# Altium schematic sheet HDMI.SchDoc
size A2; SheetNumber: 22; SheetTotal: 23
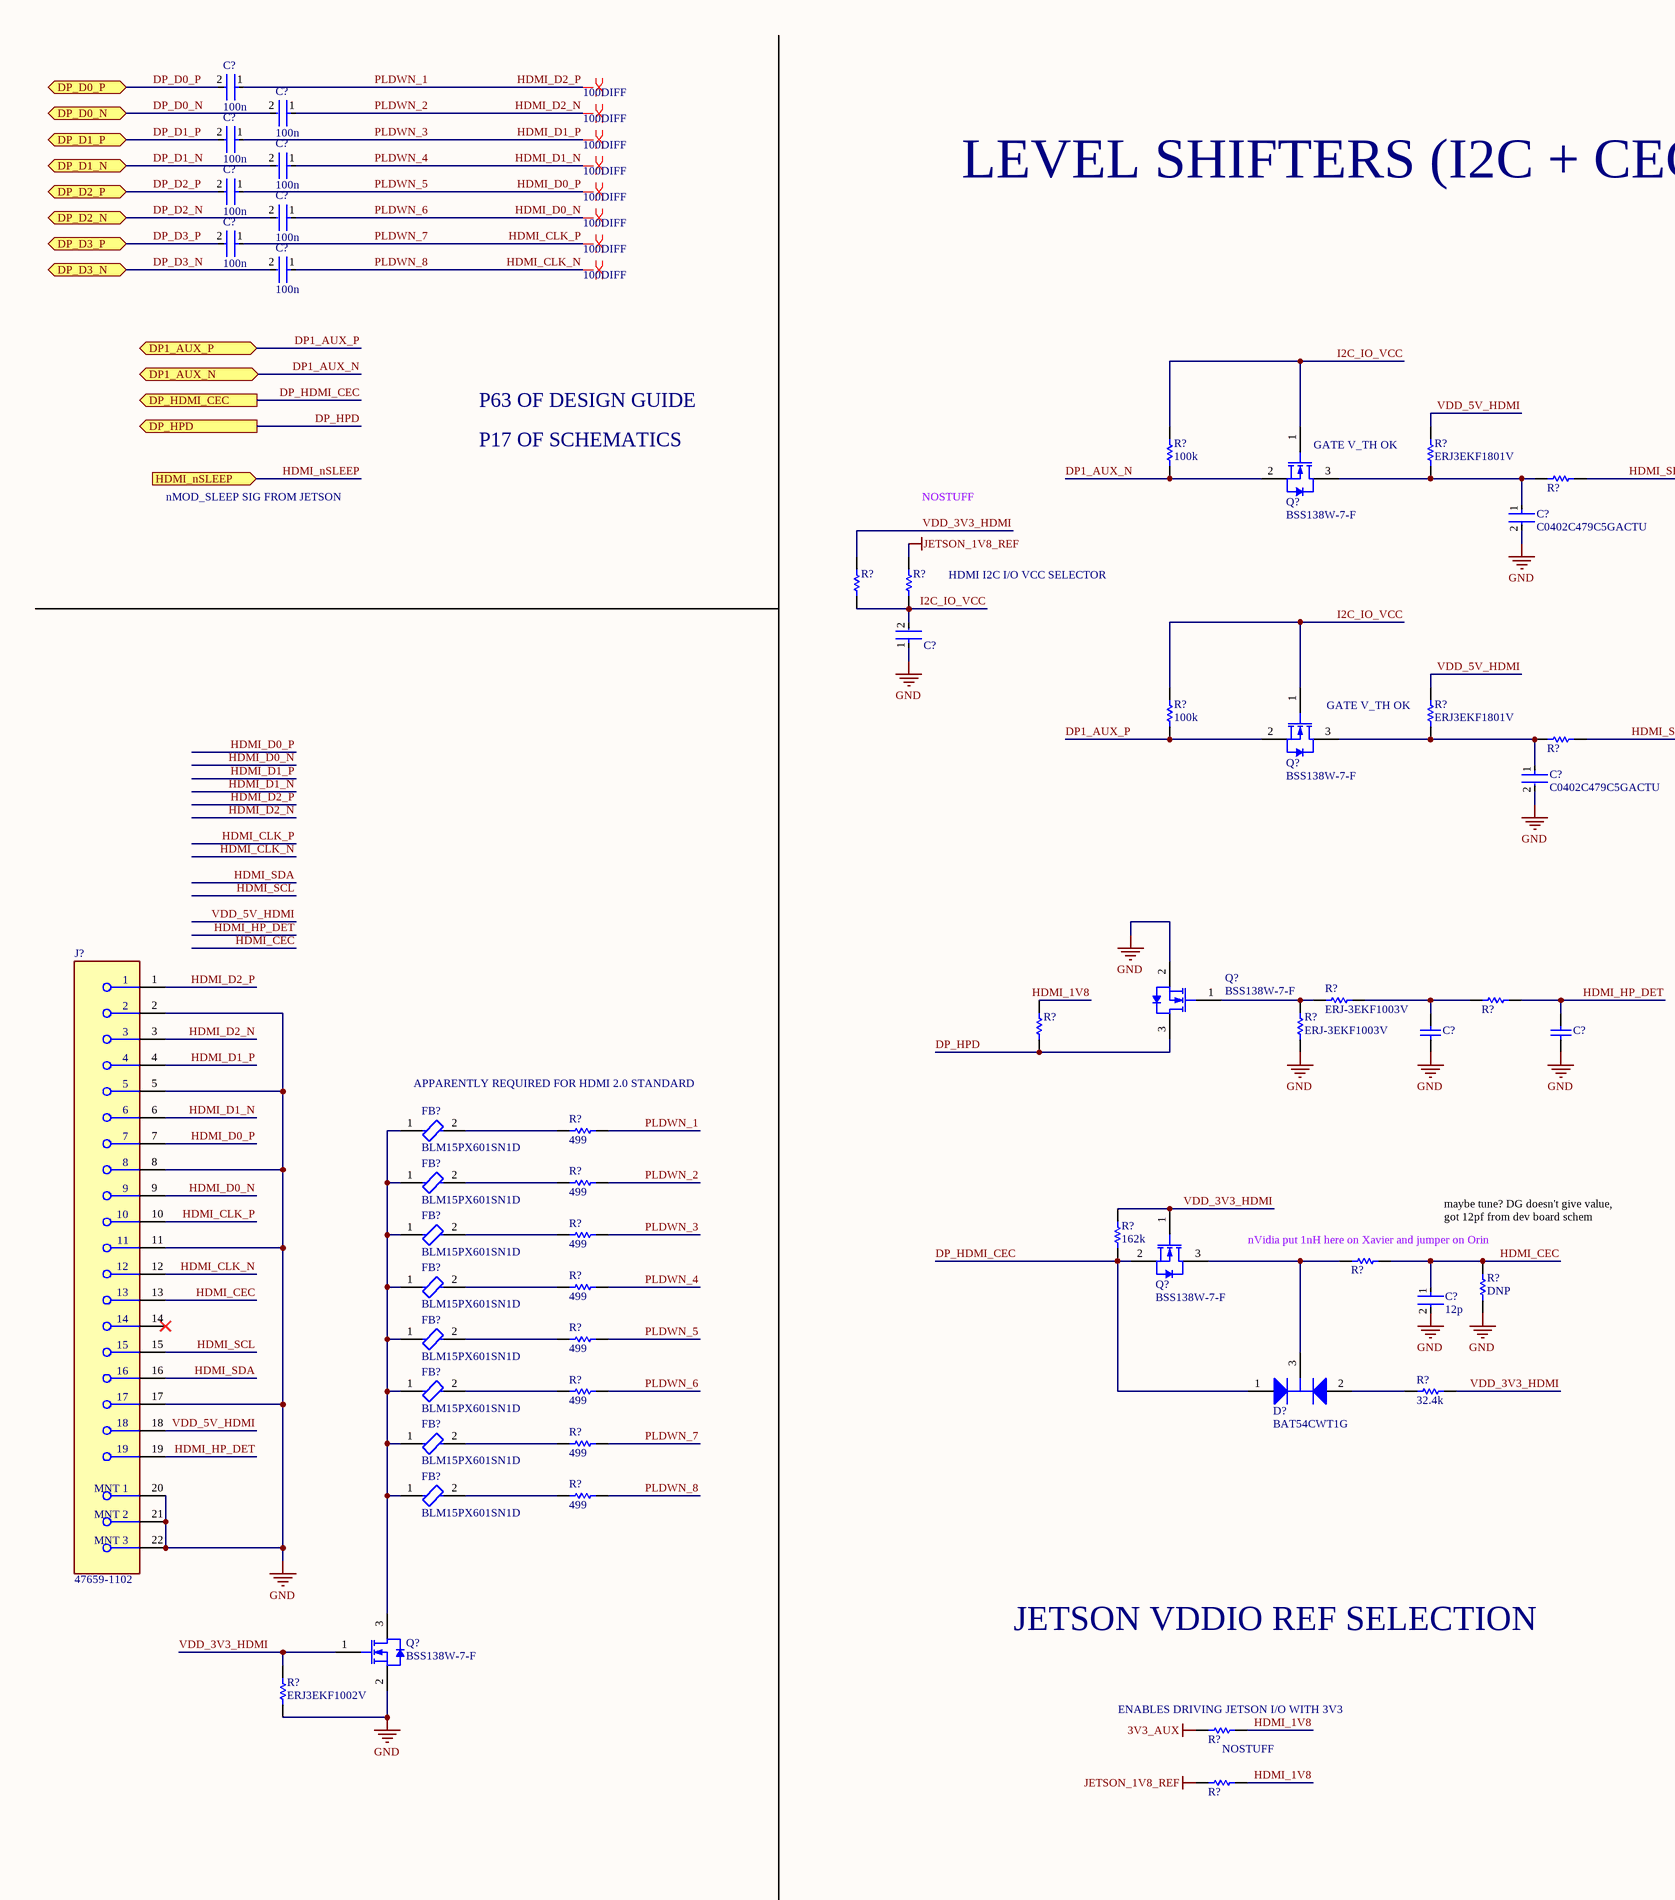
[diagram p0: HDMI.SchDoc, left]
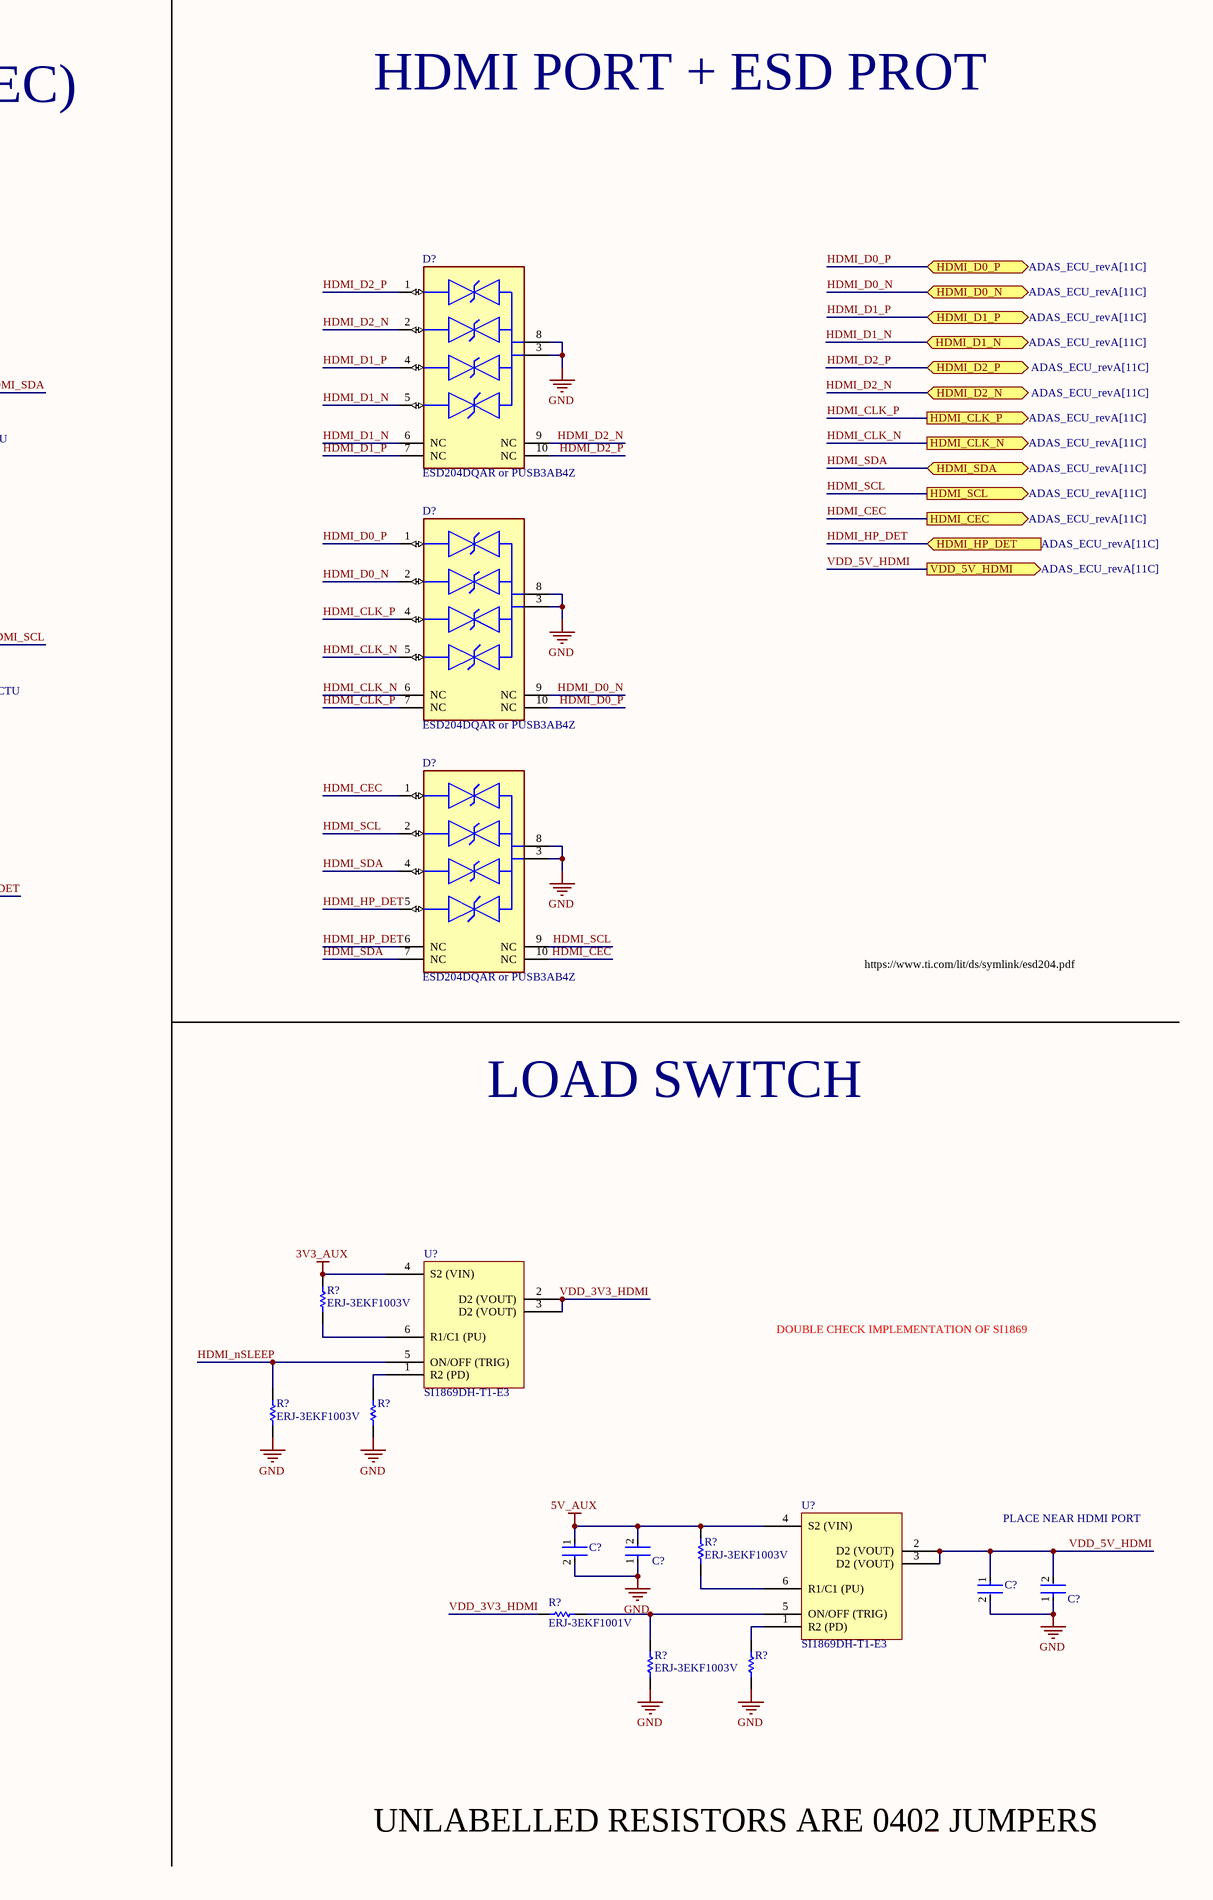
[diagram p1: HDMI.SchDoc, right]

## Parts
(Parts that share a designator on the sheet are numbered #1, #2 ... from top to bottom, then left to right.)
C?#1  100n  [FP-0402-L_1_0_0_05-W_0_5-IPC_A]
C?#2  100n  [FP-0402-L_1_0_0_05-W_0_5-IPC_A]
C?#3  100n  [FP-0402-L_1_0_0_05-W_0_5-IPC_A]
C?#4  100n  [FP-0402-L_1_0_0_05-W_0_5-IPC_A]
C?#5  100n  [FP-0402-L_1_0_0_05-W_0_5-IPC_A]
C?#6  100n  [FP-0402-L_1_0_0_05-W_0_5-IPC_A]
C?#7  100n  [FP-0402-L_1_0_0_05-W_0_5-IPC_A]
C?#8  100n  [FP-0402-L_1_0_0_05-W_0_5-IPC_A]
C?#9  C0402C479C5GACTU  [FP-C0402-BB-MFG]
C?#10  C1005X7R1H104K050BB  [FP-C1005-050-0_05-IPC_C]  (value not drawn)
C?#11  C0402C479C5GACTU  [FP-C0402-BB-MFG]
C?#12  C0402C221K5RAC7867  [CAPC1005X60X30NL05T10]  (value not drawn)
C?#13  C0402C221K5RAC7867  [CAPC1005X60X30NL05T10]  (value not drawn)
C?#14  12p  [FP-0402-L_1_0_0_05-W_0_5-IPC_A]
C?#15  GRM188R60J106ME47D  [FP-GRM188-0_1-e0_2_0_55-IPC_A]  (value not drawn)
C?#16  C1005X7R1H104K050BB  [FP-C1005-050-0_05-IPC_C]  (value not drawn)
C?#17  GRM188R60J106ME47D  [FP-GRM188-0_1-e0_2_0_55-IPC_A]  (value not drawn)
C?#18  C1005X7R1H104K050BB  [FP-C1005-050-0_05-IPC_C]  (value not drawn)
D?#1  ESD204DQAR or PUSB3AB4Z  [FP-DQA0010A-MFG]
D?#2  ESD204DQAR or PUSB3AB4Z  [FP-DQA0010A-MFG]
D?#3  ESD204DQAR or PUSB3AB4Z  [FP-DQA0010A-MFG]
D?#4  BAT54CWT1G  [ONSC-SOT-323-3-419-04_V]
FB?#1  BLM15PX601SN1D  [FP-BLM15-0_05-MFG]
FB?#2  BLM15PX601SN1D  [FP-BLM15-0_05-MFG]
FB?#3  BLM15PX601SN1D  [FP-BLM15-0_05-MFG]
FB?#4  BLM15PX601SN1D  [FP-BLM15-0_05-MFG]
FB?#5  BLM15PX601SN1D  [FP-BLM15-0_05-MFG]
FB?#6  BLM15PX601SN1D  [FP-BLM15-0_05-MFG]
FB?#7  BLM15PX601SN1D  [FP-BLM15-0_05-MFG]
FB?#8  BLM15PX601SN1D  [FP-BLM15-0_05-MFG]
J?  47659-1102  [FP-47659-1102-MFG]
Q?#1  BSS138W-7-F  [DIOD-SOT323-3_V]
Q?#2  BSS138W-7-F  [DIOD-SOT323-3_V]
Q?#3  BSS138W-7-F  [DIOD-SOT323-3_V]
Q?#4  BSS138W-7-F  [DIOD-SOT323-3_V]
Q?#5  BSS138W-7-F  [DIOD-SOT323-3_V]
R?#1  100k  [R0603B]
R?#2  ERJ3EKF1801V  [RESC1608X55X30LL15T15]
R?#3  0402 JUMPER  [RESC1005X40X25ML05T05]  (value not drawn)
R?#4  0402 JUMPER  [RESC1005X40X25ML05T05]  (value not drawn)
R?#5  0402 JUMPER  [RESC1005X40X25ML05T05]  (value not drawn)
R?#6  100k  [R0603B]
R?#7  ERJ3EKF1801V  [RESC1608X55X30LL15T15]
R?#8  0402 JUMPER  [RESC1005X40X25ML05T05]  (value not drawn)
R?#9  ERJ-3EKF1003V  [RESC1608X55X30ML15T15]
R?#10  0402 JUMPER  [RESC1005X40X25ML05T05]  (value not drawn)
R?#11  ERJ3EKF1002V  [RESC1609X55X30LL15T15]  (value not drawn)
R?#12  ERJ-3EKF1003V  [RESC1608X55X30ML15T15]
R?#13  499  [R0603B]
R?#14  499  [R0603B]
R?#15  499  [R0603B]
R?#16  162k  [R0603B]
R?#17  0402 JUMPER  [RESC1005X40X25ML05T05]  (value not drawn)
R?#18  499  [R0603B]
R?#19  DNP  [R0603B]
R?#20  499  [R0603B]
R?#21  499  [R0603B]
R?#22  32.4k  [R0603B]
R?#23  ERJ-3EKF1003V  [RESC1608X55X30ML15T15]
R?#24  499  [R0603B]
R?#25  499  [R0603B]
R?#26  0402 JUMPER  [RESC1005X40X25ML05T05]  (value not drawn)
R?#27  ERJ-3EKF1003V  [RESC1608X55X30ML15T15]
R?#28  ERJ-3EKF1003V  [RESC1608X55X30ML15T15]
R?#29  ERJ3EKF1002V  [RESC1609X55X30LL15T15]
R?#30  0402 JUMPER  [RESC1005X40X25ML05T05]  (value not drawn)
R?#31  ERJ-3EKF1001V  [RESC1608X55X30LL15T15]
R?#32  0402 JUMPER  [RESC1005X40X25ML05T05]  (value not drawn)
R?#33  0402 JUMPER  [RESC1005X40X25ML05T05]  (value not drawn)
R?#34  ERJ-3EKF1003V  [RESC1608X55X30ML15T15]
U?#1  SI1869DH-T1-E3  [SOT65P242X110-6N]
U?#2  SI1869DH-T1-E3  [SOT65P242X110-6N]

## Ports
DP1_AUX_N (bidir, see ADAS_ECU_revA[10C]), DP1_AUX_P (bidir, see ADAS_ECU_revA[10C]), DP_D0_N (bidir, see ADAS_ECU_revA[10C]), DP_D0_P (bidir, see ADAS_ECU_revA[10C]), DP_D1_N (bidir, see ADAS_ECU_revA[10C]), DP_D1_P (bidir, see ADAS_ECU_revA[10C]), DP_D2_N (bidir, see ADAS_ECU_revA[10C]), DP_D2_P (bidir, see ADAS_ECU_revA[10C]), DP_D3_N (bidir, see ADAS_ECU_revA[10C]), DP_D3_P (bidir, see ADAS_ECU_revA[10C]), DP_HDMI_CEC (out, see ADAS_ECU_revA[10C]), DP_HPD (out, see ADAS_ECU_revA[10C]), HDMI_CEC (out, see ADAS_ECU_revA[11C]), HDMI_CLK_N (out, see ADAS_ECU_revA[11C]), HDMI_CLK_P (out, see ADAS_ECU_revA[11C]), HDMI_D0_N (bidir, see ADAS_ECU_revA[11C]), HDMI_D0_P (bidir, see ADAS_ECU_revA[11C]), HDMI_D1_N (bidir, see ADAS_ECU_revA[11C]), HDMI_D1_P (bidir, see ADAS_ECU_revA[11C]), HDMI_D2_N (bidir, see ADAS_ECU_revA[11C]), HDMI_D2_P (bidir, see ADAS_ECU_revA[11C]), HDMI_HP_DET (in, see ADAS_ECU_revA[11C]), HDMI_nSLEEP (in, see ADAS_ECU_revA[10C]), HDMI_SCL (out, see ADAS_ECU_revA[11C]), HDMI_SDA (bidir, see ADAS_ECU_revA[11C]), VDD_5V_HDMI (out, see ADAS_ECU_revA[11C])

## Nets
3V3_AUX: R?#23.2 R?#30.1 U?#1.4(S2_(VIN))
5V_AUX: C?#15.1 C?#16.2 R?#28.2 U?#2.4(S2_(VIN))
GND: C?#9.2 C?#10.1 C?#11.2 C?#12.1 C?#13.1 C?#14.2 C?#15.2 C?#16.1 C?#17.2 C?#18.1 D?#1.3(GND) D?#1.8(GND) D?#2.3(GND) D?#2.8(GND) D?#3.3(GND) D?#3.8(GND) J?.2 J?.5 J?.8 J?.11 J?.17 J?.20(MNT_1) J?.21(MNT_2) J?.22(MNT_3) Q?#3.2(S) Q?#5.2(S) R?#12.1 R?#19.1 R?#26.2 R?#27.1 R?#29.1 R?#33.2 R?#34.1
JETSON_1V8_REF: R?#5.2 R?#32.1
DP1_AUX_N: Q?#1.2(S) R?#1.1 ; port DP1_AUX_N
DP1_AUX_P: Q?#2.2(S) R?#6.1 ; port DP1_AUX_P
DP_D0_N: C?#2.2 ; port DP_D0_N
DP_D0_P: C?#1.2 ; port DP_D0_P
DP_D1_N: C?#4.2 ; port DP_D1_N
DP_D1_P: C?#3.2 ; port DP_D1_P
DP_D2_N: C?#6.2 ; port DP_D2_N
DP_D2_P: C?#5.2 ; port DP_D2_P
DP_D3_N: C?#8.2 ; port DP_D3_N
DP_D3_P: C?#7.2 ; port DP_D3_P
DP_HDMI_CEC: D?#4.1(A1) Q?#4.2(S) R?#16.2 ; port DP_HDMI_CEC
DP_HPD: Q?#3.3(D) R?#11.1 ; port DP_HPD
HDMI_1V8: R?#11.2 R?#30.2 R?#32.2
HDMI_CEC: C?#14.1 D?#3.1(IO1) D?#3.10(NC) J?.13 R?#17.2 R?#19.2 ; port HDMI_CEC
HDMI_CLK_N: C?#8.1 D?#2.5(IO4) D?#2.6(NC) J?.12 R?#25.2 ; port HDMI_CLK_N  [also labelled PLDWN_8]
HDMI_CLK_P: C?#7.1 D?#2.4(IO3) D?#2.7(NC) J?.10 R?#24.2 ; port HDMI_CLK_P  [also labelled PLDWN_7]
HDMI_D0_N: C?#6.1 D?#2.2(IO2) D?#2.9(NC) J?.9 R?#21.2 ; port HDMI_D0_N  [also labelled PLDWN_6]
HDMI_D0_P: C?#5.1 D?#2.1(IO1) D?#2.10(NC) J?.7 R?#20.2 ; port HDMI_D0_P  [also labelled PLDWN_5]
HDMI_D1_N: C?#4.1 D?#1.5(IO4) D?#1.6(NC) J?.6 R?#18.2 ; port HDMI_D1_N  [also labelled PLDWN_4]
HDMI_D1_P: C?#3.1 D?#1.4(IO3) D?#1.7(NC) J?.4 R?#15.2 ; port HDMI_D1_P  [also labelled PLDWN_3]
HDMI_D2_N: C?#2.1 D?#1.2(IO2) D?#1.9(NC) J?.3 R?#14.2  [also labelled PLDWN_2]
HDMI_D2_P: C?#1.1 D?#1.1(IO1) D?#1.10(NC) J?.1 R?#13.2 ; port HDMI_D2_P  [also labelled PLDWN_1]
HDMI_HP_DET: C?#13.2 D?#3.5(IO4) D?#3.6(NC) J?.19 R?#10.2 ; port HDMI_HP_DET
HDMI_nSLEEP: R?#27.2 U?#1.5(ON/OFF_(TRIG)) ; port HDMI_nSLEEP
HDMI_SCL: D?#3.2(IO2) D?#3.9(NC) J?.15 R?#8.2 ; port HDMI_SCL
HDMI_SDA: D?#3.4(IO3) D?#3.7(NC) J?.16 R?#3.2 ; port HDMI_SDA
I2C_IO_VCC: C?#10.2 Q?#1.1(G) Q?#2.1(G) R?#1.2 R?#4.1 R?#5.1 R?#6.2
VDD_3V3_HDMI: Q?#4.1(G) Q?#5.1(G) R?#4.2 R?#16.1 R?#22.1 R?#29.2 R?#31.1 U?#1.2(D2_(VOUT)) U?#1.3(D2_(VOUT))
VDD_5V_HDMI: C?#17.1 C?#18.2 J?.18 R?#2.2 R?#7.2 U?#2.2(D2_(VOUT)) U?#2.3(D2_(VOUT)) ; port VDD_5V_HDMI
NetC?#9_1: C?#9.1 Q?#1.3(D) R?#2.1 R?#3.1
NetC?#11_1: C?#11.1 Q?#2.3(D) R?#7.1 R?#8.1
NetC?#12_2: C?#12.2 R?#9.2 R?#10.1
NetD?#4_2: D?#4.2(A2) R?#22.2
NetD?#4_3: D?#4.3(K) Q?#4.3(D) R?#17.1
NetFB?#1_1: FB?#1.1 FB?#2.1 FB?#3.1 FB?#4.1 FB?#5.1 FB?#6.1 FB?#7.1 FB?#8.1 Q?#5.3(D)
NetFB?#1_2: FB?#1.2 R?#13.1
NetFB?#2_2: FB?#2.2 R?#14.1
NetFB?#3_2: FB?#3.2 R?#15.1
NetFB?#4_2: FB?#4.2 R?#18.1
NetFB?#5_2: FB?#5.2 R?#20.1
NetFB?#6_2: FB?#6.2 R?#21.1
NetFB?#7_2: FB?#7.2 R?#24.1
NetFB?#8_2: FB?#8.2 R?#25.1
NetQ?#3_1: Q?#3.1(G) R?#9.1 R?#12.2
NetR?#23_1: R?#23.1 U?#1.6(R1/C1_(PU))
NetR?#26_1: R?#26.1 U?#1.1(R2_(PD))
NetR?#28_1: R?#28.1 U?#2.6(R1/C1_(PU))
NetR?#31_2: R?#31.2 R?#34.2 U?#2.5(ON/OFF_(TRIG))
NetR?#33_1: R?#33.1 U?#2.1(R2_(PD))

Not connected (* = marked no-connect by the designer): J? 14*

## Layout directives
differential pair; differential pair class 100DIFF: HDMI_CLK_N, HDMI_CLK_P, HDMI_D0_N, HDMI_D0_P, HDMI_D1_N, HDMI_D1_P, HDMI_D2_N, HDMI_D2_P

## Notes on the sheet
- HDMI PORT + ESD PROT
- LEVEL SHIFTERS (I2C + CEC)
- P63 OF DESIGN GUIDE
- nMOD_SLEEP SIG FROM JETSON
- P17 OF SCHEMATICS
- NOSTUFF
- (near Q?#1) GATE V_TH OK
- HDMI I2C I/O VCC SELECTOR
- (near Q?#2) GATE V_TH OK
- APPARENTLY REQUIRED FOR HDMI 2.0 STANDARD
- https://www.ti.com/lit/ds/symlink/esd204.pdf
- maybe tune? DG doesn't give value, got 12pf from dev board schem
- LOAD SWITCH
- (near R?#17) nVidia put 1nH here on Xavier and jumper on Orin
- DOUBLE CHECK IMPLEMENTATION OF SI1869
- JETSON VDDIO REF SELECTION
- PLACE NEAR HDMI PORT
- (near R?#30) ENABLES DRIVING JETSON I/O WITH 3V3
- (near R?#30) NOSTUFF
- UNLABELLED RESISTORS ARE 0402 JUMPERS
- Labels drawn without touching a wire or pin: HDMI_D2_N

## Library data of the parts
C?#1-C?#8 C?#14 = CMP-001-00058-1: LARGE PADS, 0402 CAP, CHANGE COMMENT TO MATCH REAL P/N; Capacitor Type: Ceramic; Min Operating Temperature: -55°C; Mounting Technology: Surface Mount; Pins: 2; Case/Package: 0402; RoHS Compliant: Yes; Max Operating Temperature: 85°C
C?#9 C?#11 = CMP-2008-03310-2: CAP CER 4.7PF 50V NP0 0402; Manufacturer: Kemet; Material: Ceramic; Tolerance: 0.25 pF; Temperature Coefficient: 15%; Temperature Characteristic: C0G; Manufacturer Part Number: C0402C479C5GACTU; Lead Free: Yes; Device Class L1: Passive Components; ComponentLink2Description: Datasheet; Temperature: -55°C to +125°C; Digikey Description: CAP CER 4.7PF 50V NP0 0402; Ipc Land Pattern Name: CAPC10050X50; ComponentLink2URL: https://content.kemet.com/datasheets/KEM_C1002_X7R_SMD.pdf; Octopart: https://octopart.com/c0402c479c5gactu-kemet-9144199; Mouser Description: Multilayer Ceramic Capacitors MLCC - SMD/SMT 50volts 4.7pF C0G .25pF; Automotive: No; Voltage Rating: 50 V; Device Class L3: Ceramic Capacitors; Capacitance: 4.7 pF; Category: Cap; Value: 4.7 pF; Package: C0402-BB; Height: 0.55mm; Temperature Range Low: -55°C; RoHS: TRUE; Device Class L2: Capacitors; Temperature Range High: +125°C
C?#10 C?#16 C?#18 = CMP-2000-05393-2: Multilayer Ceramic Capacitors 100nF ±10% 50V X7R SMD 0402; Voltage: 50V; Dielectric Material: Ceramic; Min Operating Temperature: -55°C; Depth: 0.5mm; Radiation Hardening: No; RoHS Compliant: Yes; Voltage Rating (DC): 50V; Lead Free: Lead Free; Resistor Type: Ceramic; Height: 0.5mm; Dielectric: X7R; Thickness: 0.022inch; Case/Package: 0402; Case Code (Metric): 1005; Termination: SMD/SMT; Capacitance: 100nF; Packaging: Tape and Reel; Max Operating Temperature: 125°C; Mount: Surface Mount; Package Quantity: 1; Width: 0.02inch; Weight: 2.3E-05oz; Voltage Rating: 50V; Tolerance: 10%; Construction: Flat; Case Code (Imperial): 0402; Length: 1mm; REACH SVHC: No SVHC; Series: C
C?#12 C?#13 = CMP-2008-03137-2: Manufacturer: Kemet; Part Number: C0402C221K5RAC7867
C?#15 C?#17 = CMP-2006-02792-2: Chip Multilayer Ceramic Capacitors for General Purpose, 0603, 10uF, X5R, 15%, 20%, 6.3V; Packaging: Tape and Reel; Voltage Rating (DC): 6.3V; Width: 0.031inch; Termination: SMD/SMT; Dielectric: X5R; Package Quantity: 4000; Voltage Rating: 6.3V; Capacitance: 10uF; Case/Package: 0603; Min Operating Temperature: -55°C; Voltage: 6.3V; Length: 1.6mm; Thickness: 0.035inch; Lead Free: Lead Free; Depth: 0.8mm; Case Code (Imperial): 0603; Max Operating Temperature: 85°C; Material: Ceramic; Height: 0.8mm; Tolerance: 20%; Mount: Surface Mount; REACH SVHC: No SVHC; Radiation Hardening: No; Case Code (Metric): 1608
D?#1-D?#3 = CMP-04989-000002-1: 4-CHANNEL LOW-CAPACITANCE SURGE; Manufacturer: Texas Instruments; Value: 0.55pF; Reverse Standoff Voltage: 3.6V; Standoff Height: 0mm; Breakdown Voltage: 5.5V; Peak Pulse Current: 5.5A; Clamping Voltage: 11.5V; Direction: Bidirectional; Peak Pulse Power: 50W; Number Of Channels: 4; Ambient Temperature Range High: +125°C; ComponentLink2Description: Datasheet; Height: 0.55mm; Lead Free: Yes; Device Class L3: unset; Temperature Range High: +125°C; Temperature Range Low: -40°C; Package: DQA0010A; Temperature: -40°C to +125°C; Capacitance: 0.55pF; RoHS: TRUE; Mouser Description: 4-Channel Low-Capacitance Surge and ESD Protection Diode 10-USON -40 to 125; Category: Diode; Device Class L1: Circuit Protection; Octopart: https://octopart.com/esd204dqar-texas+instruments-89917476; Device Class L2: TVS Diodes; Ambient Temperature Range Low: -40°C; Manufacturer Part Number: ESD204DQAR; ComponentLink2URL: http://www.ti.com/lit/ds/symlink/esd204.pdf; Automotive: No; Digikey Description: 4-CHANNEL LOW-CAPACITANCE SURGE
D?#4 = CMP-1055-00557-1: Dual Series Cathode Schottky Barrier Diodes, 3-Pin SOT-323, Pb-Free, Tape and Reel; Manufacturer: On Semiconductor; Configuration: Common Cathode; IFSM Max (A): 0.6; trr Max (ns): 5; ComponentLink2Description: Datasheet; Packing: Tape and Reel; ComponentLink3Description: Package Specification; Mounting Technology: Surface Mount; PartNumber: BAT54CWT1G; PackageVersion: Rev. N, 11/2008; RoHS: TRUE; ComponentLink3URL: http://www.onsemi.com/pub_link/Collateral/419-04.PDF; ComponentLink2URL: http://www.onsemi.cn/pub_link/Collateral/BAT54CWT1-D.PDF; PackageReference: SOT-323-3-419-04; ComponentLink1URL: http://www.onsemi.com/; ComponentLink1Description: Manufacturer URL; DatasheetVersion: Rev. 7; PackageDescription: 3-Pin Small Outline Transistor, Body 2 x 1.25 mm, Pitch 0.65 mm
FB?#1-FB?#8 = CMP-0686-00252-4: Chip Ferrite Bead, 0402, 600Ω @ 100MHz, 0.23Ω, 25%, 900mA; Number of Circuits: 1; Impedance: 600R; DC Resistance (DCR): 230mR; Material: Steel; Length: 1mm; Package Quantity: 10000; Height: 0.5mm; Width: 0.5mm; Max DC Current: 900mA; Number of Lines: 1; Termination: SMD/SMT; Packaging: Tape and Reel; Lead Free: Lead Free; Min Operating Temperature: -55°C; Max Operating Temperature: 125°C; Max Current Rating: 900mA; Case Code (Imperial): 0402; Number of Pins: 2; Current Rating: 900mA; Test Frequency: 100MHz; Case/Package: 0402; Tolerance: 25%; Case Code (Metric): 1005
J? = CMP-04768-000010-1: HDMI REC.VERTICAL SMT TYPE W/HEI; RoHS Compliant: Yes
Q?#1-Q?#5 = CMP-2000-05968-1: N-Channel Enhancement Mode Mosfet, 50 V, 200 mA, -55 to 150 degC, 6-Pin SOT-323, RoHS, Tape and Reel; Typical Turn-Off Delay Time: 20ns; Number of Channels: 1Channel; Type: EnhancementModeFieldEffectTransistor; Brand: DiodesIncorporated; Vds - Drain-Source Breakdown Voltage: 75V; Vgs - Gate-Source Voltage: 20V; Rds On - Drain-Source Resistance: 1.4Ohms; Transistor Type: 1N-Channel; Configuration: Single; Unit Weight: 0.000212oz; Pd - Power Dissipation: 200mW; Id - Continuous Drain Current: 200mA; Forward Transconductance - Min: 0.1S; Manufacturer URL: http://www.diodes.com/; Series: BSS138; Package Description: 3-Pin Small Outline Transistor, Body 2 x 1.25 mm, Pitch 0.65 mm; Mounting Technology: SurfaceMount; Product Category: MOSFET; RoHS: True; Maximum Operating Temperature: +150C; Height: 1mm; Length: 2.2mm; Technology: Si; Width: 1.35mm; Datasheet URL: http://www.diodes.com/_files/datasheets/ds30206.pdf; Manufacturer: DiodesIncorporated; Package / Case: SOT-323-3; Typical Turn-On Delay Time: 20ns; Transistor Polarity: N-Channel; Factory Pack Quantity: 3000; Packaging: Reel; Product: MOSFETSmallSignal; Datasheet Version: Rev. 11-2, 09/2013; Package Reference: SOT323; Minimum Operating Temperature: -55C; Mounting Style: SMD/SMT; Channel Mode: Enhancement
R?#1 R?#6 R?#13-R?#16 R?#18-R?#22 R?#24 R?#25 = CMP-009-00002-14: Resistor
R?#2 R?#7 = CMP-2000-00389-1: MODIFIED P/N; Manufacturer: Panasonic; Part Number: ERJ3EKF2701V
R?#3-R?#5 R?#8 R?#10 R?#17 R?#26 R?#30 R?#32 R?#33 = CMP-009-00118-2: READ THE NAME; Pins: 2; Component Type: Standard; Design Item ID: CMP-009-00206-2; Source: 0402jump.SchLib
R?#9 R?#12 R?#23 R?#27 R?#28 R?#34 = CMP-2000-00182-1: Manufacturer: Panasonic; Part Number: ERJ-3EKF1003V
R?#11 R?#29 = CMP-1012-00623-3: Chip Resistor, 10 KOhm, +/- 1%, 0.1 W, -55 to 155 degC, 0603 (1608 Metric), RoHS, Tape and Reel; Manufacturer: Panasonic; Voltage Rating: 75V; Case\/Package: 0603; Power Rating: 100mW; Resistance: 10KOhm; Temperature Coefficient: 100ppm\/degreesC; Number of Pins: 2; Package Reference: 603; Depth: 0.8mm; Mount: SurfaceMount; Package Description: 2-Pin Surface Mount Device, Body 1.6 x 0.85 mm; Datasheet Version: 02/2017; Length: 1.6mm; Lead Free: LeadFree; Height: 0.45mm; Number of Terminations: 2; Max Power Dissipation: 100mW; Min Operating Temperature: -55degC; Datasheet URL: https://industrial.panasonic.com/cdbs/www-data/pdf/RDA0000/AOA0000C304.pdf; Termination: SMD/SMT; Case Code (Metric): 1608; Case Code (Imperial): 0603; Tolerance: 1%; Max Operating Temperature: 155degC; RoHSCompliant: true; Voltage Rating (DC): 75V; Radiation Hardening: No; Packaging: TapeandReel; Composition: ThickFilm; Mounting Technology: SurfaceMount; Manufacturer URL: http://www.panasonic.com/; Width: 0.031inch; REACH SVHC: NoSVHC; Contact Plating: Tin; Military Standard: Not; Package Quantity: 1
R?#31 = CMP-2000-00180-1: Manufacturer: Panasonic; Part Number: ERJ-3EKF1001V
U?#1 U?#2 = CMP-019-00043-2: Power Supply Support Circuit, Adjustable, 1 Channel, PDSO6; Max Supply Voltage: 20V; Min Supply Voltage: 1.8V; Case/Package: TSSOP; Pins: 6; RoHS Compliant: Yes